# EAGLE design rockchip-mics (EAGLE 7.7.0)
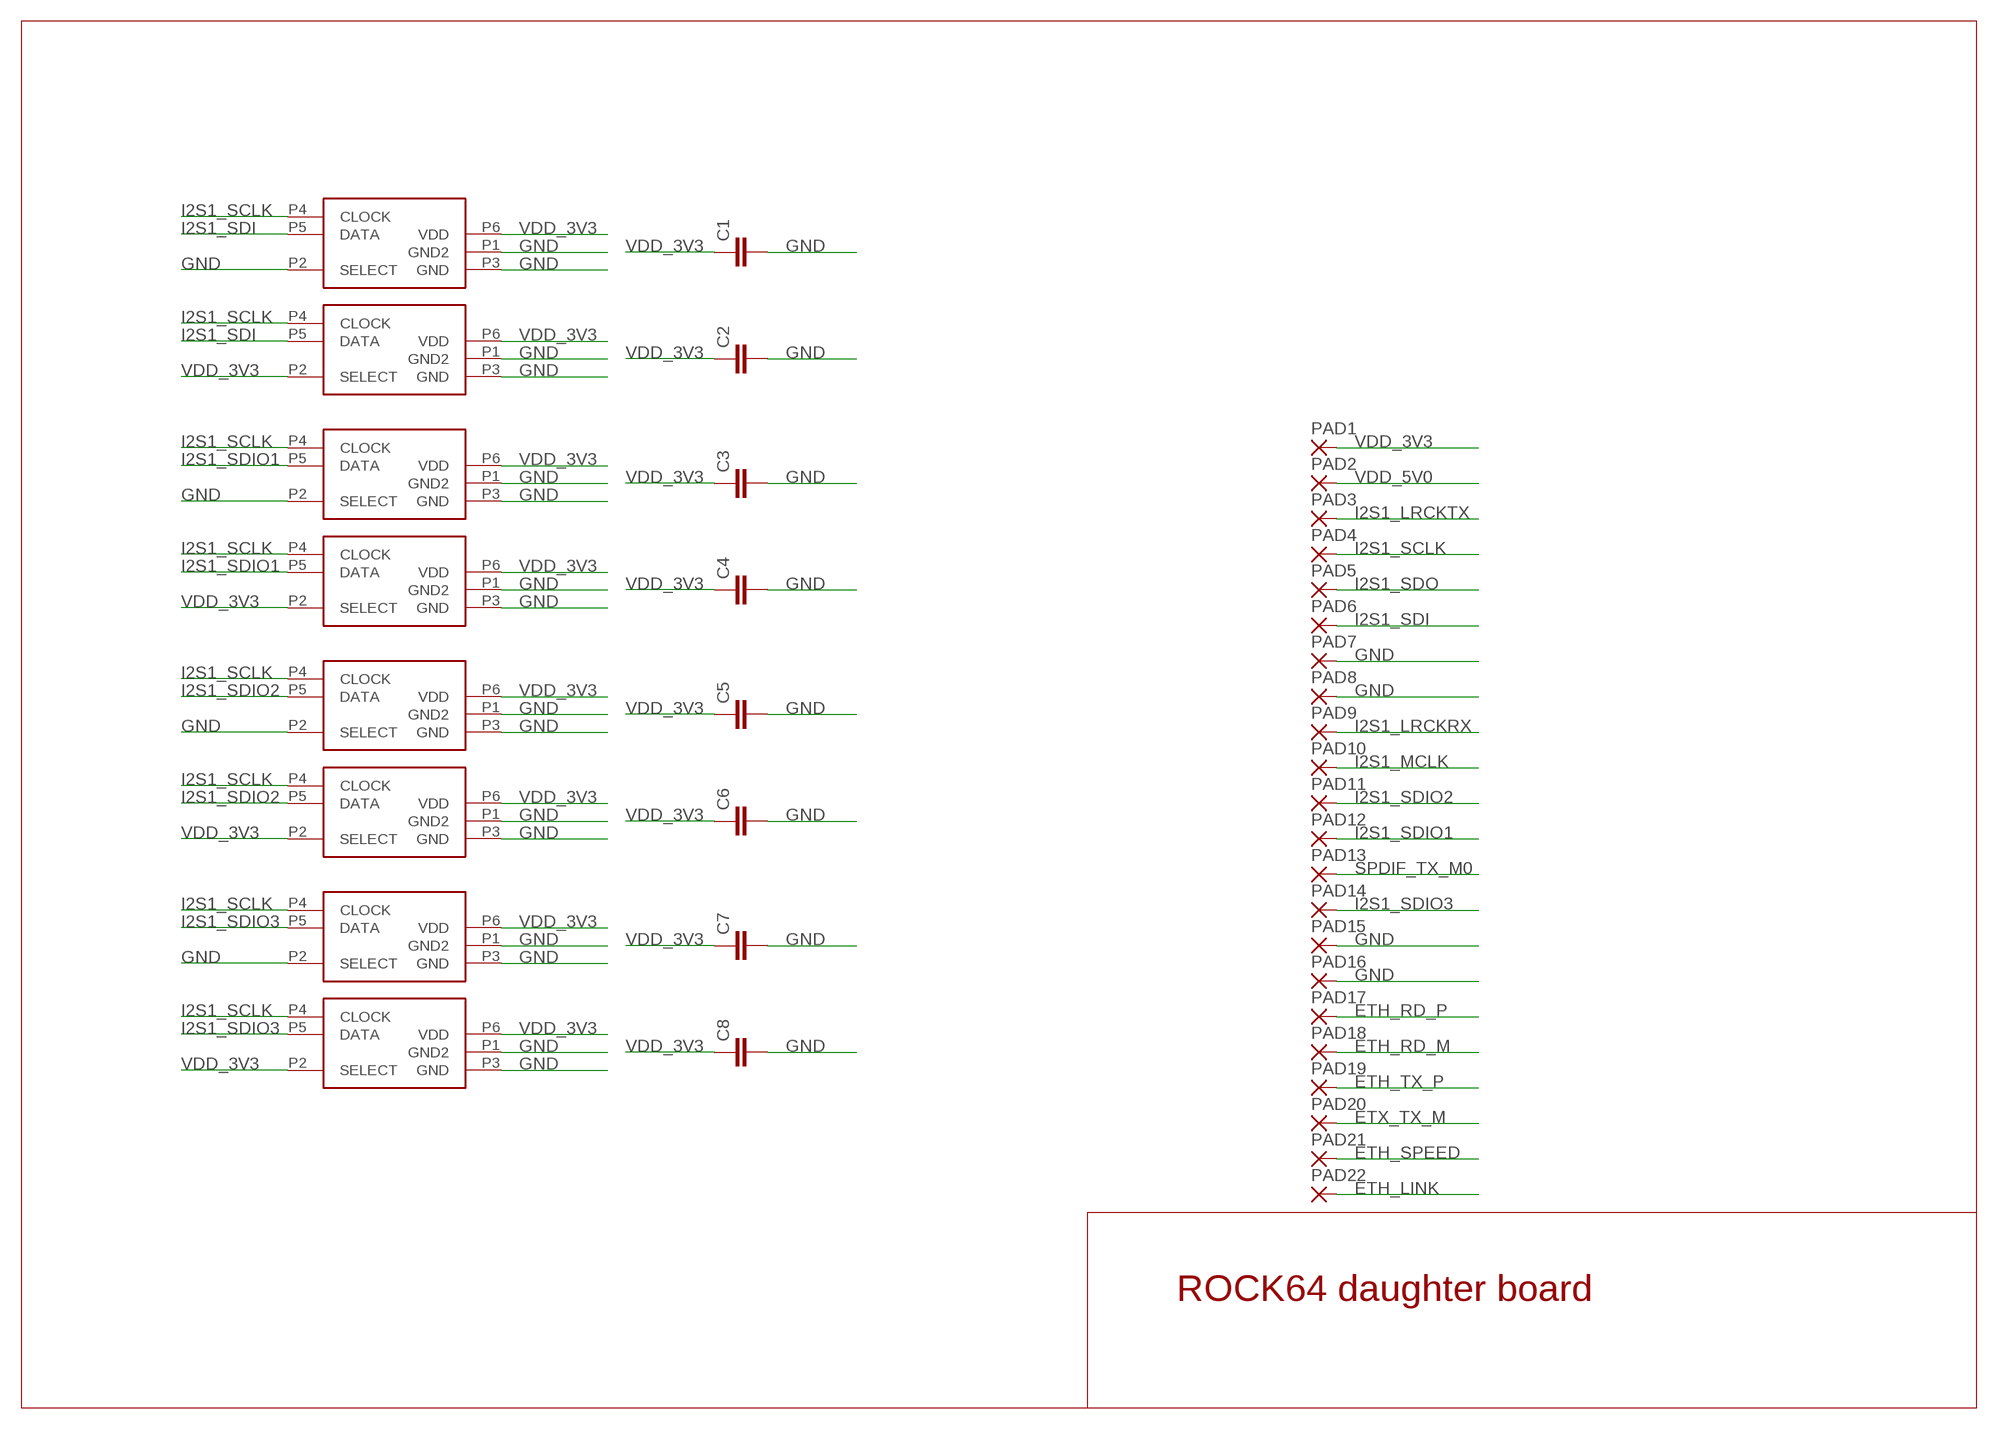
[diagram p0: schematic, sheet 1]

## Parts
C1  C-EUC1206  [C1206]
C2  C-EUC1206  [C1206]
C3  C-EUC1206  [C1206]
C4  C-EUC1206  [C1206]
C5  C-EUC1206  [C1206]
C6  C-EUC1206  [C1206]
C7  C-EUC1206  [C1206]
C8  C-EUC1206  [C1206]
PAD1  1,6/0,8  [1,6/0,8]
PAD2  1,6/0,8  [1,6/0,8]
PAD3  1,6/0,8  [1,6/0,8]
PAD4  1,6/0,8  [1,6/0,8]
PAD5  1,6/0,8  [1,6/0,8]
PAD6  1,6/0,8  [1,6/0,8]
PAD7  1,6/0,8  [1,6/0,8]
PAD8  1,6/0,8  [1,6/0,8]
PAD9  1,6/0,8  [1,6/0,8]
PAD10  1,6/0,8  [1,6/0,8]
PAD11  1,6/0,8  [1,6/0,8]
PAD12  1,6/0,8  [1,6/0,8]
PAD13  1,6/0,8  [1,6/0,8]
PAD14  1,6/0,8  [1,6/0,8]
PAD15  1,6/0,8  [1,6/0,8]
PAD16  1,6/0,8  [1,6/0,8]
PAD17  1,6/0,8  [1,6/0,8]
PAD18  1,6/0,8  [1,6/0,8]
PAD19  1,6/0,8  [1,6/0,8]
PAD20  1,6/0,8  [1,6/0,8]
PAD21  1,6/0,8  [1,6/0,8]
PAD22  1,6/0,8  [1,6/0,8]
U$1  SPM0423SMD  [SPM0423]
U$2  SPM0423SMD  [SPM0423]
U$3  SPM0423SMD  [SPM0423]
U$4  SPM0423SMD  [SPM0423]
U$5  SPM0423SMD  [SPM0423]
U$6  SPM0423SMD  [SPM0423]
U$7  SPM0423SMD  [SPM0423]
U$8  SPM0423SMD  [SPM0423]

## Nets
ETH_LINK: PAD22.1(P)
ETH_RD_M: PAD18.1(P)
ETH_RD_P: PAD17.1(P)
ETH_SPEED: PAD21.1(P)
ETH_TX_P: PAD19.1(P)
ETX_TX_M: PAD20.1(P)
GND: C1.2 C2.2 C3.2 C4.2 C5.2 C6.2 C7.2 C8.2 PAD7.1(P) PAD8.1(P) PAD15.1(P) PAD16.1(P) U$1.P1(GND2) U$1.P2(SELECT) U$1.P3(GND) U$2.P1(GND2) U$2.P3(GND) U$3.P1(GND2) U$3.P2(SELECT) U$3.P3(GND) U$4.P1(GND2) U$4.P3(GND) U$5.P1(GND2) U$5.P2(SELECT) U$5.P3(GND) U$6.P1(GND2) U$6.P3(GND) U$7.P1(GND2) U$7.P2(SELECT) U$7.P3(GND) U$8.P1(GND2) U$8.P3(GND)
I2S1_LRCKRX: PAD9.1(P)
I2S1_LRCKTX: PAD3.1(P)
I2S1_MCLK: PAD10.1(P)
I2S1_SCLK: PAD4.1(P) U$1.P4(CLOCK) U$2.P4(CLOCK) U$3.P4(CLOCK) U$4.P4(CLOCK) U$5.P4(CLOCK) U$6.P4(CLOCK) U$7.P4(CLOCK) U$8.P4(CLOCK)
I2S1_SDI: PAD6.1(P) U$1.P5(DATA) U$2.P5(DATA)
I2S1_SDIO1: PAD12.1(P) U$3.P5(DATA) U$4.P5(DATA)
I2S1_SDIO2: PAD11.1(P) U$5.P5(DATA) U$6.P5(DATA)
I2S1_SDIO3: PAD14.1(P) U$7.P5(DATA) U$8.P5(DATA)
I2S1_SDO: PAD5.1(P)
SPDIF_TX_M0: PAD13.1(P)
VDD_3V3: C1.1 C2.1 C3.1 C4.1 C5.1 C6.1 C7.1 C8.1 PAD1.1(P) U$1.P6(VDD) U$2.P2(SELECT) U$2.P6(VDD) U$3.P6(VDD) U$4.P2(SELECT) U$4.P6(VDD) U$5.P6(VDD) U$6.P2(SELECT) U$6.P6(VDD) U$7.P6(VDD) U$8.P2(SELECT) U$8.P6(VDD)
VDD_5V0: PAD2.1(P)

## Notes on the sheet
- ROCK64 daughter board

## Library data of the parts
C1-C8 = rcl:C-EU: CAPACITOR, European symbol
PAD1-PAD22 = wirepad:1,6/0,8: THROUGH-HOLE PAD
U$1-U$8 = SPM0423:SPM0423: SPM0423

## Board
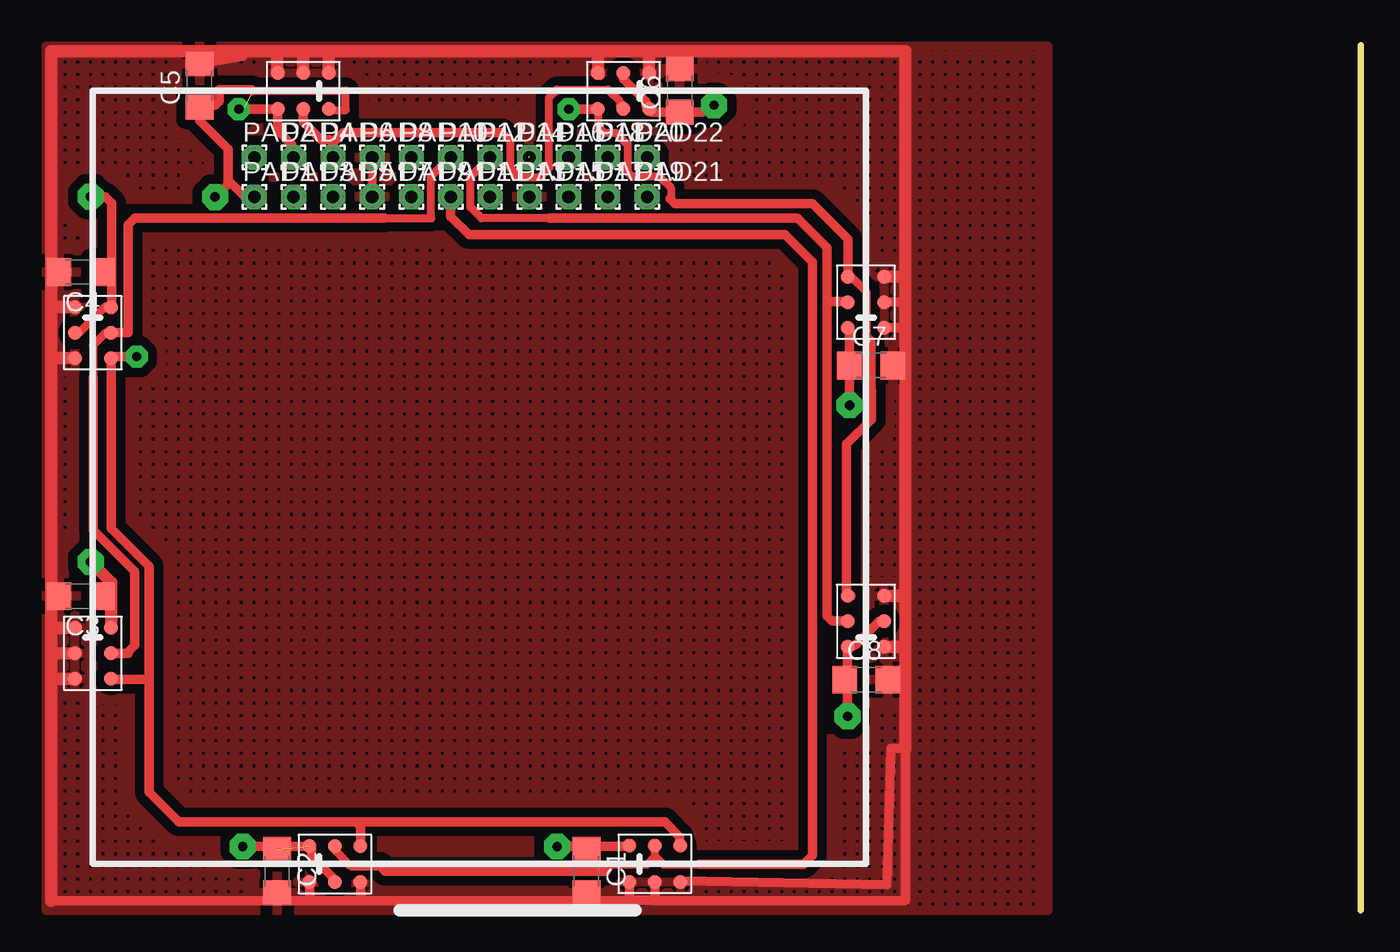
[diagram p1: board, top side]
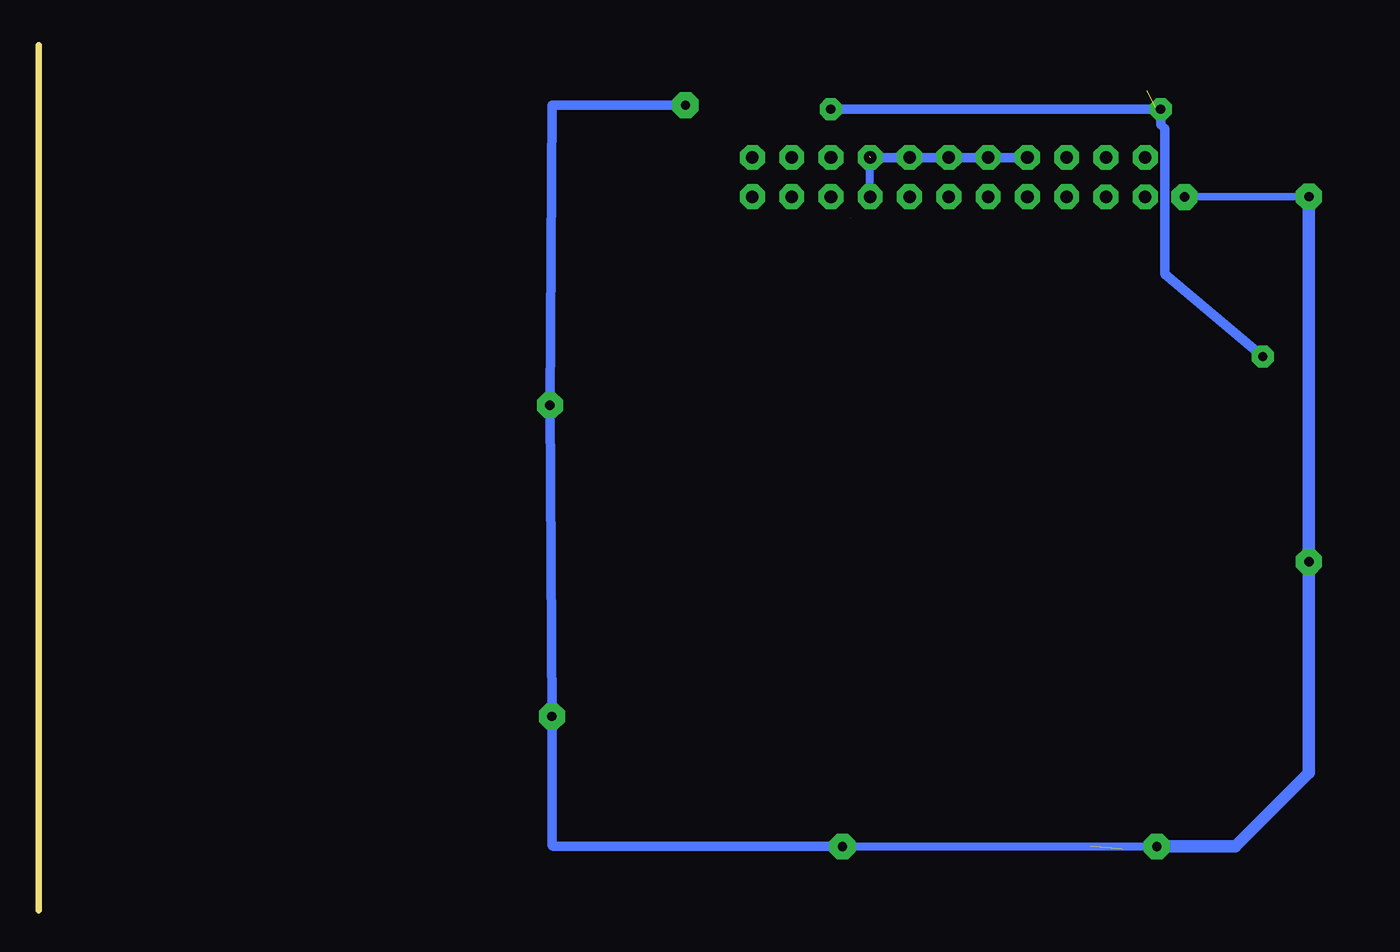
[diagram p2: board, bottom side, seen from below]

Size 0 x 55.94 mm. Coordinates in mm from the lower left corner, seen from the top.
Outline: 0,0 0,55.94
Copper layers (1*16): Top 0.035mm / dielectric 1.5mm / Bottom 0.035mm
Design rules "default": minimum track width 10mil, minimum drill 24mil, track to track 8mil, track to pad 8mil, pad to pad 8mil, via to via 8mil, smd to smd 8mil, copper to edge 40mil, drill to drill 8mil, minimum pad ring 10mil, minimum via ring 8mil, stop-mask expansion 4mil, vias tented up to drill 0mil, thermal gap 10mil

### Footprints (pad centres in the part's own frame; a part is rotated, then mirrored left to right if it is on the bottom)
C1206 = smd 1.6 x 1.8: 1 -1.4,0; 2 1.4,0
1,6/0,8 = drill 0.813 pad 1.6 octagon: 1 0,0
SPM0423 = smd 0.91 x 0.91: P1 0.71,4.01; P2 0.71,2.36; P3 0.71,0.71; P4 3.05,0.71; P5 3.05,2.36; P6 3.05,4.01

### Placement (x,y rotation side)
C1  -50.08,2.54 270 top  (outside the outline)
C2  -70.08,2.54 270 top  (outside the outline)
C3  -82.78,20.32 180 top  (outside the outline)
C4  -82.78,41.27 180 top  (outside the outline)
C5  -75.09,53.34 90 top  (outside the outline)
C6  -44.04,53.02 90 top  (outside the outline)
C7  -31.66,35.24 0 top  (outside the outline)
C8  -31.98,14.92 0 top  (outside the outline)
PAD1  -71.56,46.15 0 top  (outside the outline)
PAD2  -71.56,48.69 0 top  (outside the outline)
PAD3  -69.02,46.15 0 top  (outside the outline)
PAD4  -69.02,48.69 0 top  (outside the outline)
PAD5  -66.47,46.15 0 top  (outside the outline)
PAD6  -66.47,48.69 0 top  (outside the outline)
PAD7  -63.93,46.15 0 top  (outside the outline)
PAD8  -63.93,48.69 0 top  (outside the outline)
PAD9  -61.39,46.15 0 top  (outside the outline)
PAD10  -61.39,48.69 0 top  (outside the outline)
PAD11  -58.85,46.15 0 top  (outside the outline)
PAD12  -58.85,48.69 0 top  (outside the outline)
PAD13  -56.31,46.15 0 top  (outside the outline)
PAD14  -56.31,48.69 0 top  (outside the outline)
PAD15  -53.77,46.15 0 top  (outside the outline)
PAD16  -53.77,48.69 0 top  (outside the outline)
PAD17  -51.23,46.15 0 top  (outside the outline)
PAD18  -51.23,48.69 0 top  (outside the outline)
PAD19  -48.69,46.15 0 top  (outside the outline)
PAD20  -48.69,48.69 0 top  (outside the outline)
PAD21  -46.15,46.15 0 top  (outside the outline)
PAD22  -46.15,48.69 0 top  (outside the outline)
U$1  -70.75,54.86 270 top  (outside the outline)
U$2  -50.04,54.86 270 top  (outside the outline)
U$3  -83.87,14.26 0 top  (outside the outline)
U$4  -83.87,35 0 top  (outside the outline)
U$5  -43.29,1.13 90 top  (outside the outline)
U$6  -63.97,1.12 90 top  (outside the outline)
U$7  -30.12,41.69 180 top  (outside the outline)
U$8  -30.12,21.06 180 top  (outside the outline)

### Tracks (layer width: path | path; a pad name or v marks a point on that pad's centre or on a via)
GND  (1 unrouted)
  Top 0.508: U$2.P3 -49.15,53.98 | PAD8.1 PAD7.1
  Top 0.61: U$5.P2 -45.65,0.66 | -45.65,0.66 -45.63,0.64 -29.44,0.64 -29.44,10.48 -30.39,10.48 -30.64,1.65 -44,1.91 U$5.P3 | U$5.P1 -47.3,0.72 | -47.3,0.72 -47.22,0.64 -47.19,0.66 -45.65,0.66 | -84.68,0.64 -68.17,0.64 | -68.17,0.64 -64.68,0.64 | -64.68,0.64 -50.08,0.64 | -50.08,0.64 -47.39,0.64 -47.3,0.72 | U$6.P1 -67.98,0.83 -68.17,0.64 | U$6.P3 -64.68,0.64 | U$7.P2 -29.72,39.33 -29.44,39.05 | U$7.P1 -29.54,37.68 -29.44,37.78 | C1.2 -50.08,0.64 | C3.2 -84.68,20.32 | C4.2 -84.68,41.27 | C5.2 -72.3,55.24 -71.98,55.56 | C6.2 -44.04,55.24 -43.73,55.56 | C7.2 -29.44,35.24 | C8.2 -29.76,14.92 -29.44,14.61
  Top 0.813: -84.68,0.64 -84.68,14.97 | -84.68,14.97 -84.68,16.62 | -84.68,16.62 -84.68,18.27 | -84.68,18.27 -84.68,20.32 -84.68,35.71 | -84.68,35.71 -84.68,39.01 | -84.68,39.01 -84.68,41.27 -84.68,55.56 -71.98,55.56 -70.08,55.56 | -70.08,55.56 -70.08,54.19 U$1.P3 | U$1.P2 -68.39,55.56 | -68.39,55.56 -70.08,55.56 | -68.39,55.56 -66.59,55.56 | -66.59,55.56 -49.33,55.56 | U$2.P3 -49.33,55.56 | -46.03,55.56 -49.33,55.56 | U$2.P1 -46.03,55.56 | -46.03,55.56 -43.73,55.56 -29.44,55.56 -29.44,40.98 | U$7.P3 -29.44,40.98 | U$8.P3 -30.81,20.32 -29.44,20.32 | -29.44,20.32 -29.44,35.24 -29.44,37.78 -29.44,39.05 -29.44,40.98 | U$8.P1 -29.44,17.05 | -29.44,17.05 -29.44,20.32 | U$4.P1 -84.68,39.01 | U$4.P3 -84.68,35.71 | U$3.P3 -84.68,14.97 | U$3.P2 -84.68,16.62 | U$3.P1 -84.68,18.27 | U$1.P1 -66.74,55.41 -66.59,55.56 | -29.44,10.48 -29.44,14.61 -29.44,17.05
  Bottom 0.508: PAD15.1 -53.76,46.15 -53.76,48.77
  Bottom 0.61: PAD8.1 PAD16.1
  pour Top (isolate 0.61, hatched): -85,0 -20.23,0 -20.23,55.88 -85,55.88
I2S1_SCLK  (via drill 0.6 pad 1.42)
  Top 0.508: U$7.P4 -32.96,40.98 -31.98,40.01 -31.98,37.15 -31.66,36.83 -31.66,33.66 | U$2.P4 -49.33,50.69 -48.93,50.29 -48.17,50.29 -47.41,49.53 -47.41,47.75 -47.15,47.5 -45.38,47.5 -44.61,46.74 -44.61,46.1 -44.68,46.04
  Top 0.61: PAD4.1 -69.12,48.8 -69.12,49.53 -70.04,50.45 U$1.P4 v-72.55,51.81 v-72.55,51.82 | -78.33,14.92 -78.33,22.23 -80.82,24.71 U$4.P4 -80.72,35.81 v-79.16,35.81 | U$5.P4 -44.04,4.22 -44.04,4.76 -44.99,5.71 -65,5.71 | -32.96,20.35 U$8.P4 -33.25,20.42 -33.25,30.16 -31.66,31.75 -31.66,33.66 | U$7.P4 -33.17,43.42 -35.47,45.72 -44.36,45.72 -44.68,46.04 | -64.64,4.13 U$6.P4 -64.68,5.4 -65,5.71 | -80.87,14.92 U$3.P4 -80.77,14.92 -78.33,14.92 | -78.33,14.92 -78.33,7.62 -76.43,5.71 -65,5.71 | U$2.P4 v-51.22,51.82
  Bottom 0.61: v-51.22,51.82 v-72.55,51.82 -72.55,50.8 -72.81,50.55 -72.81,41.15 v-79.16,35.81
I2S1_SDI
  Top 0.508: -66.47,49.64 PAD6.1 | -47.68,52.09 U$2.P5 -47.92,52.05 -47.92,52.32 -48.68,53.09 -51.98,53.09 -52.49,52.58 -52.49,48.01 -53.07,47.42 -54.44,47.42 -55.03,48.01 -55.03,49.78 -55.54,50.29
  Top 0.61: U$1.P5 -68.39,51.02 -67.22,49.85 -66.68,49.85 -66.47,49.64 -65.82,50.29 -55.54,50.29
I2S1_SDIO1
  Top 0.508: U$4.P5 -81.17,37.36 -81.98,36.55 -81.98,34.44 | -63.12,44.77 -60.11,44.77 -60.11,47.5 -58.91,48.69 PAD12.1
  Top 0.61: -81.98,34.44 -81.98,24.6 -79.28,21.91 -79.28,17.14 -79.72,16.71 -79.72,16.62 U$3.P5 | -63.12,44.77 -79.28,44.77 -79.71,44.35 -79.71,37.36 U$4.P5
I2S1_SDIO2
  Top 0.508: -66.27,4.23 -66.27,3.81 -65.31,2.86 -63.41,2.86 | -48.8,2.54 -48.37,2.97 -46.14,2.97 -45.63,3.48 | -45.63,3.48 -45.63,4.16 U$5.P5 | -45.63,3.48 -45.12,2.97 -42.81,2.97
  Top 0.61: -66.27,4.23 U$6.P5 | PAD11.1 -58.85,44.88 -57.66,43.69 -37.25,43.69 -35.47,41.91 -35.47,3.56 -36.05,2.97 -42.81,2.97 | -48.8,2.54 -63.09,2.54 -63.41,2.86
I2S1_SDIO3  (1 unrouted)
  Top 0.508: -56.31,48.15 PAD14.1 -57.57,47.44 -57.57,45.47 -56.86,44.76 -52.49,44.76
  Top 0.61: -34.52,39.37 -33.21,39.37 U$7.P5 | -34.52,39.37 -34.52,42.86 -36.42,44.77 -52.49,44.77 | -34.52,39.37 -34.52,19.05 -34.2,18.73 -33.21,18.73 U$8.P5
VDD_3V3  (via drill 0.6 pad 1.68)  (2 unrouted)
  Top 0.508: U$4.P6 -80.86,39.05 -81.19,39.05 -82.88,37.36 U$4.P2 | -71.66,53.02 -65.63,53.02 -65.63,51.75 -66.74,51.75 U$1.P6
  Top 0.61: U$6.P2 -66.33,1.97 -67.86,3.49 -67.86,4.04 U$6.P6 -68.02,4.13 v-72.3,4.13 | v-51.98,4.13 -50.08,4.13 | -50.08,4.13 -47.36,4.13 U$5.P6 | U$7.P6 -33.17,37.76 -33.06,37.76 v-33.06,32.66 -33.06,32.79 C7.1 | U$8.P2 -31.15,18.7 -32.6,17.25 arc-52 U$8.P6 -33.18,17.04 -33.18,14.92 | U$2.P2 -47.68,53.76 -46.21,52.3 -46.21,52 U$2.P6 -45.84,51.62 C6.1 -42.59,51.62 -42.14,52.07 v-41.82,52.07 | v-33.18,12.55 -33.18,14.92 | PAD1.1 -72.19,46.15 -73.25,47.21 | U$4.P6 -80.78,39.05 -80.78,41.27 | -73.25,47.21 -73.25,49.21 -75.09,51.05 C5.1 -74.96,52.07 -74.08,52.07 -73.82,52.32 -73.82,53.09 -71.73,53.09 -71.66,53.02 | -80.78,41.27 -80.78,45.75 -81.19,46.16 v-82.14,46.16 | C1.1 -50.08,4.13 | C3.1 -80.82,20.32 | C4.1 -80.78,41.27 | -72.17,51.94 -71.98,51.75 | C8.1 -33.18,14.92 | v-74.09,46.14 -73.25,46.98 -73.25,47.21
  Top 0.813: U$3.P6 -80.82,20.32 -80.82,21.22 v-82.14,22.54
  Bottom 0.508: v-51.98,4.13 v-72.3,4.13 | -81.51,46.16 v-74.09,46.14
  Bottom 0.61: v-51.98,4.13 -33.25,4.13 -33.18,4.19 v-33.18,12.55 v-33.06,32.66 -33.18,52.07 v-41.82,52.07 | -81.51,46.16 v-82.14,46.16
  Bottom 0.813: v-82.14,46.16 v-82.14,22.54 -82.14,8.89 -77.38,4.13 v-72.3,4.13